# EAGLE schematic AD620 (EAGLE 9.6.2)
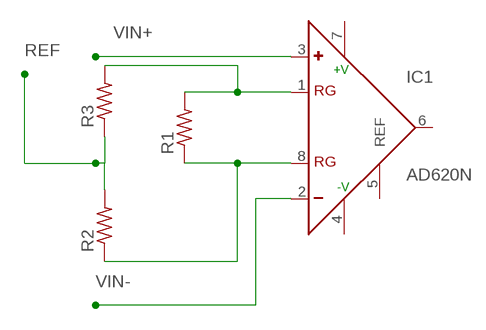
[diagram p0: schematic, sheet 1]

## Parts
IC1  AD620N  [DIL08]
R1  R-US_0204/5  [0204/5]
R2  R-US_0204/5  [0204/5]
R3  R-US_0204/5  [0204/5]

## Nets
N$1: IC1.8(RG) R1.1 R2.1
N$4: IC1.1(RG) R1.2 R3.2
REF: R2.2 R3.1
VIN+: IC1.3(+)
VIN-: IC1.2(-)
Unconnected: IC1.5(REF) IC1.6(OUT)

## Power pins joined to a net without a drawn wire
+V: IC1.7(+V)
-V: IC1.4(-V)

## Library data of the parts
IC1 = analog-devices:AD620: Low Cost, Low Power, Instrumentation Amplifier Source: http://www.analog.com/UploadedFiles/Data_Sheets/37793330023930AD620_e.pdf; MF: ALTERA CORPORATION; MPN: AD620AN; OC_FARNELL: 1523782; OC_NEWARK: 05F7108
R1-R3 = rcl:R-US_: RESISTOR, American symbol; SPICEPREFIX: R